# Altium project VXX2.PrjPcb
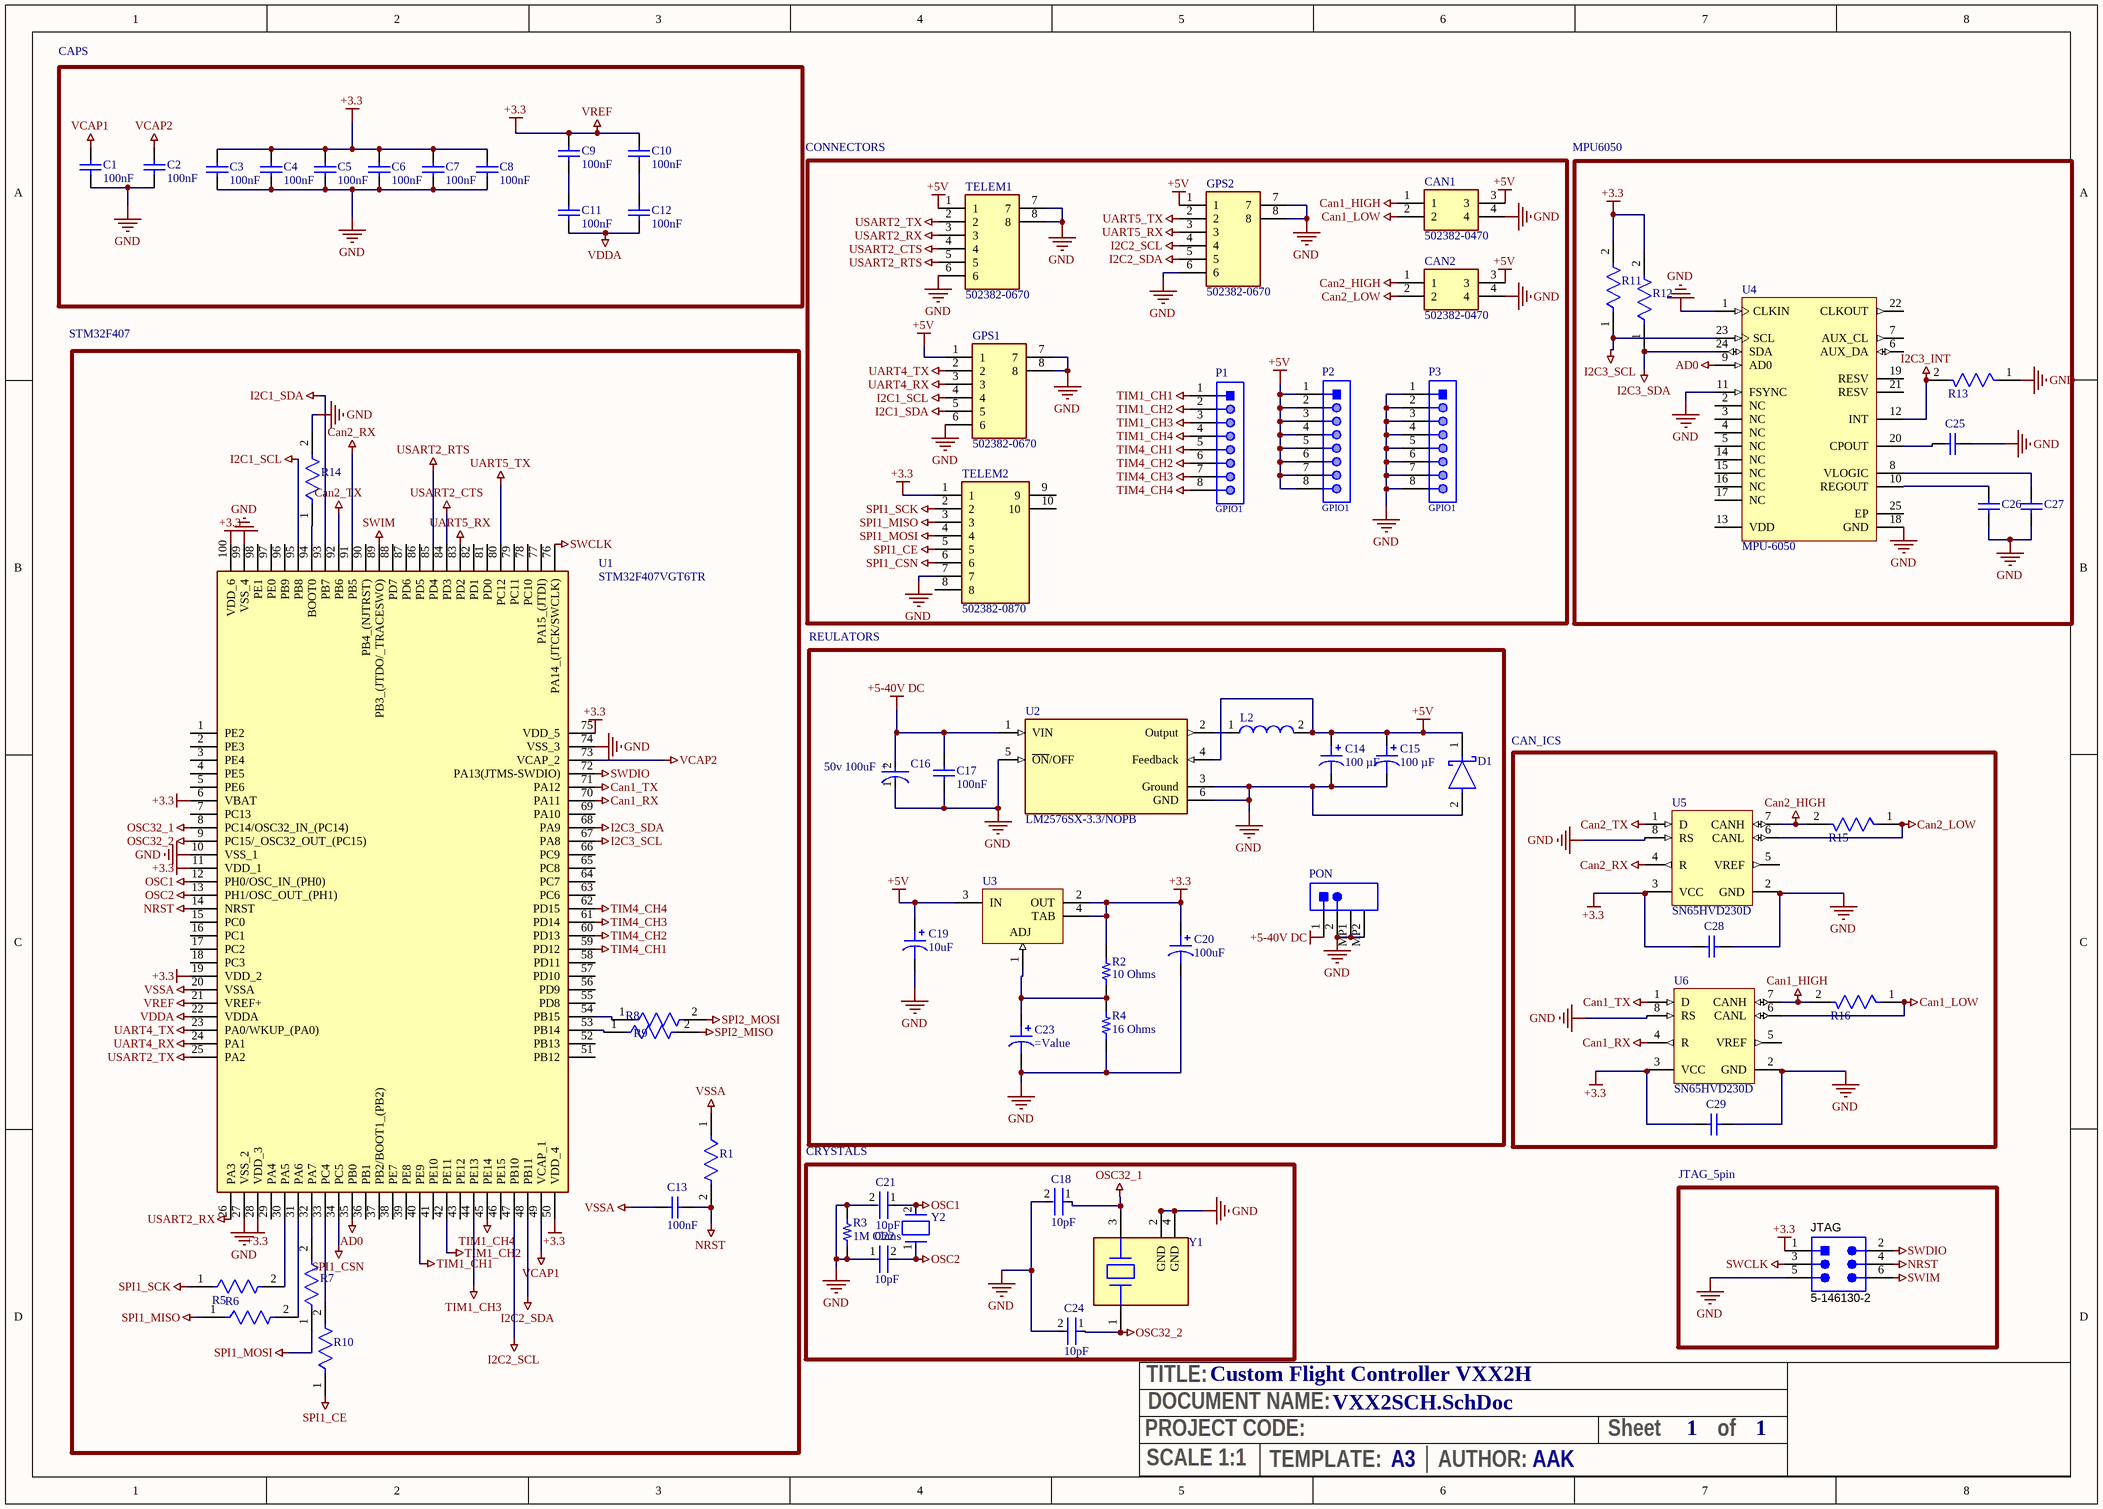
[diagram p0: VXX2SCH.SchDoc]
1 sheet, 66 parts. Net scope: global (net labels, ports and power ports of the same name join across sheets).
Board file: VXX2PCB.PcbDoc

## Sheet VXX2SCH.SchDoc: Custom Flight Controller VXX2H
size A3; Date: 24/06/2022; ApprovedBy: *AAK; CheckedBy: *AAK; Author: AAK; CompanyName: AAK; DrawnBy: *AAK; Engineer: Alper Korkmaz; Organization: *AAK; DocumentNumber: *AAK; Revision: AAK; SheetNumber: 1; SheetTotal: 1; Time: 13.56

### Parts
C1  100nF  [CAPC2013X135X45ML10T25]
C2  100nF  [CAPC2013X135X45ML10T25]
C3  100nF  [CAPC2013X135X45ML10T25]
C4  100nF  [CAPC2013X135X45ML10T25]
C5  100nF  [CAPC2013X135X45ML10T25]
C6  100nF  [CAPC2013X135X45ML10T25]
C7  100nF  [CAPC2013X135X45ML10T25]
C8  100nF  [CAPC2013X135X45ML10T25]
C9  100nF  [CAPC2013X135X45ML10T25]
C10  100nF  [CAPC2013X135X45ML10T25]
C11  100nF  [CAPC2013X135X45ML10T25]
C12  100nF  [CAPC2013X135X45ML10T25]
C13  100nF  [CAPC2013X135X45ML10T25]
C14  100 µF  [CAP ALSMD 6.6MM H8.0MM]
C15  100 µF  [CAP ALSMD 6.6MM H8.0MM]
C16  50v 100uF  [FP-SC-MFG]
C17  100nF  [CAPC2013X135X45ML10T25]
C18  10pF  [FP-C0805C-DN-MFG]
C19  10uF  [CAP ALSMD 4.3MM H5.4MM]
C20  100uF  [CAP ALSMD 4.3MM H5.4MM]
C21  10pF  [FP-C0805C-DN-MFG]
C22  10pF  [FP-C0805C-DN-MFG]
C23  (no value)  [CAP ALSMD 4.3MM H5.4MM]
C24  10pF  [FP-C0805C-DN-MFG]
C25  GRM188R71H222KA01D  [CAPC1608X90X35NL10T15]  (value not drawn)
C26  GRM188R71H222KA01D  [CAPC1608X90X35NL10T15]  (value not drawn)
C27  GRM188R71H222KA01D  [CAPC1608X90X35NL10T15]  (value not drawn)
C28  GRM188R71H222KA01D  [CAPC1608X90X35NL10T15]  (value not drawn)
C29  GRM188R71H222KA01D  [CAPC1608X90X35NL10T15]  (value not drawn)
CAN1  502382-0470  [502382-0470]
CAN2  502382-0470  [502382-0470]
D1  MBR0560-TP  [FP-SOD-123-IPC_C]  (value not drawn)
GPS1  502382-0670  [5023820671]
GPS2  502382-0670  [5023820671]
JTAG  5-146130-2  [TECO-5-146130-2_V]
L2  7447785147  [WE-PD-XS-PB]  (value not drawn)
P1  GPIO1  [61300811121]
P2  GPIO1  [61300811121]
P3  GPIO1  [61300811121]
PON  53398-0271  [MOLX-53398-0271_V]  (value not drawn)
R1  RC0603FR-0710KL  [FP-RC0603-0_55-IPC_C]  (value not drawn)
R2  10 Ohms  [RES 0603_1608]
R3  1M Ohms  [RES 0603_1608]
R4  16 Ohms  [RES 0603_1608]
R5  RC0603FR-07100L  [FP-RC0603-0_55-IPC_C]  (value not drawn)
R6  RC0603FR-07100L  [FP-RC0603-0_55-IPC_C]  (value not drawn)
R7  RC0603FR-07100L  [FP-RC0603-0_55-IPC_C]  (value not drawn)
R8  RC0603FR-07100L  [FP-RC0603-0_55-IPC_C]  (value not drawn)
R9  RC0603FR-07100L  [FP-RC0603-0_55-IPC_C]  (value not drawn)
R10  RC0603FR-07100L  [FP-RC0603-0_55-IPC_C]  (value not drawn)
R11  RC0603FR-07100L  [FP-RC0603-0_55-IPC_C]  (value not drawn)
R12  RC0603FR-07100L  [FP-RC0603-0_55-IPC_C]  (value not drawn)
R13  RC0603FR-07100L  [FP-RC0603-0_55-IPC_C]  (value not drawn)
R14  RC0603FR-0710KL  [FP-RC0603-0_55-IPC_C]  (value not drawn)
R15  RC0603FR-07100L  [FP-RC0603-0_55-IPC_C]  (value not drawn)
R16  RC0603FR-07100L  [FP-RC0603-0_55-IPC_C]  (value not drawn)
TELEM1  502382-0670  [5023820671]
TELEM2  502382-0870  [5023820870]
U1  STM32F407VGT6TR  [QFP50P1600X1600X160-100N]
U2  LM2576SX-3.3/NOPB  [FP-KTT0005B-MFG]
U3  LM1117MPX-ADJ/NOPB  [DCY0004A_N]  (value not drawn)
U4  MPU-6050  [IS-QFN-24_V]
U5  SN65HVD230D  [D0008A_M]
U6  SN65HVD230D  [D0008A_M]
Y1  ABM3B-155-12.800MHZ-T  [FP-ABM3B-MFG]  (value not drawn)
Y2  ABM3-8.000MHZ-D2Y-T  [FP-ABM3-MFG]  (value not drawn)

### Blocks framed on the sheet
CAPS: C1-C12
CONNECTORS: CAN1 CAN2 GPS1 GPS2 P1-P3 TELEM1 TELEM2
MPU6050: C25-C27 R11-R13 U4
STM32F407: C13 R1 R5-R10 R14 U1
REULATORS: C14-C17 C19 C20 C23 D1 L2 PON R2 R4 U2 U3
CAN_ICS: C28 C29 R15 R16 U5 U6
CRYSTALS: C18 C21 C22 C24 R3 Y1 Y2
JTAG_5pin: JTAG

### Nets
+3.3: C3.2 C4.2 C5.2 C6.2 C7.2 C8.2 C9.2 C10.2 C20.1 C28.1 C29.1 JTAG.1 R2.2 R11.2 R12.2 TELEM2.1 U1.6(VBAT) U1.11(VDD_1) U1.19(VDD_2) U1.21(VREF+) U1.28(VDD_3) U1.50(VDD_4) U1.75(VDD_5) U1.100(VDD_6) U3.2(OUT) U3.4(TAB) U5.3(VCC) U6.3(VCC)  [also labelled VREF]
+5-40V DC: C16.2(A) C17.2 PON.1 U2.1(VIN)
+5V: C14.1 C15.1 C19.1 CAN1.3 CAN2.3 D1.1(C) GPS1.1 GPS2.1 L2.2 P2.1 P2.2 P2.3 P2.4 P2.5 P2.6 P2.7 P2.8 TELEM1.1 U2.4(Feedback) U3.3(IN)
AD0: U1.35(PB0) U4.9(AD0)
Can1_HIGH: CAN1.1 R16.2 U6.7(CANH)
Can1_LOW: CAN1.2 R16.1 U6.6(CANL)
Can1_RX: U1.70(PA11) U6.4(R)
Can1_TX: U1.71(PA12) U6.1(D)
Can2_HIGH: CAN2.1 R15.2 U5.7(CANH)
Can2_LOW: CAN2.2 R15.1 U5.6(CANL)
Can2_RX: U1.91(PB5) U5.4(R)
Can2_TX: U1.92(PB6) U5.1(D)
GND: C1.1 C2.1 C3.1 C4.1 C5.1 C6.1 C7.1 C8.1 C14.2 C15.2 C16.1(C) C17.1 C18.2 C19.2 C20.2 C21.2 C22.1 C23.2 C24.2 C25.2 C26.2 C27.2 C28.2 C29.2 CAN1.4 CAN2.4 D1.2(A) GPS1.6 GPS1.7 GPS1.8 GPS2.6 GPS2.7 GPS2.8 JTAG.5 P3.1 P3.2 P3.3 P3.4 P3.5 P3.6 P3.7 P3.8 PON.2 PON.MP1 PON.MP2 R3.1 R3.2 R4.1 R13.1 R14.2 TELEM1.6 TELEM1.7 TELEM1.8 TELEM2.7 U1.10(VSS_1) U1.27(VSS_2) U1.74(VSS_3) U1.99(VSS_4) U2.3(Ground) U2.5(~{ON}/OFF) U2.6(GND) U4.1(CLKIN) U4.11(FSYNC) U4.18(GND) U5.2(GND) U5.8(RS) U6.2(GND) U6.8(RS) Y1.2(GND) Y1.4(GND)
I2C1_SCL: GPS1.4 U1.95(PB8)
I2C1_SDA: GPS1.5 U1.93(PB7)
I2C2_SCL: GPS2.4 U1.47(PB10)
I2C2_SDA: GPS2.5 U1.48(PB11)
I2C3_INT: R13.2 U4.12(INT)
I2C3_SCL: R11.1 U1.67(PA8) U4.23(SCL)
I2C3_SDA: R12.1 U1.68(PA9) U4.24(SDA)
NRST: C13.2 JTAG.4 R1.2 U1.14(NRST)
OSC1: C21.1 U1.12(PH0/OSC_IN_(PH0)) Y2.2
OSC2: C22.2 U1.13(PH1/OSC_OUT_(PH1)) Y2.1
OSC32_1: C18.1 U1.8(PC14/OSC32_IN_(PC14)) Y1.3
OSC32_2: C24.1 U1.9(PC15/_OSC32_OUT_(PC15)) Y1.1
SPI1_CE: R10.1 TELEM2.5
SPI1_CSN: TELEM2.6 U1.34(PC5)
SPI1_MISO: R6.1 TELEM2.3
SPI1_MOSI: R7.1 TELEM2.4
SPI1_SCK: R5.1 TELEM2.2
SPI2_MISO: R8.2
SPI2_MOSI: R9.2
SWCLK: JTAG.3 U1.76(PA14_(JTCK/SWCLK))
SWDIO: JTAG.2 U1.72(PA13(JTMS-SWDIO))
SWIM: JTAG.6 U1.89(PB3_(JTDO/_TRACESWO))
TIM1_CH1: P1.1 U1.40(PE9)
TIM1_CH2: P1.2 U1.42(PE11)
TIM1_CH3: P1.3 U1.44(PE13)
TIM1_CH4: P1.4 U1.45(PE14)
TIM4_CH1: P1.5 U1.59(PD12)
TIM4_CH2: P1.6 U1.60(PD13)
TIM4_CH3: P1.7 U1.61(PD14)
TIM4_CH4: P1.8 U1.62(PD15)
UART4_RX: GPS1.3 U1.24(PA1)
UART4_TX: GPS1.2 U1.23(PA0/WKUP_(PA0))
UART5_RX: GPS2.3 U1.83(PD2)
UART5_TX: GPS2.2 U1.80(PC12)
USART2_CTS: TELEM1.4 U1.84(PD3)
USART2_RTS: TELEM1.5 U1.85(PD4)
USART2_RX: TELEM1.3 U1.26(PA3)
USART2_TX: TELEM1.2 U1.25(PA2)
VCAP1: C1.2 U1.49(VCAP_1)
VCAP2: C2.2 U1.73(VCAP_2)
VDDA: C11.1 C12.1 U1.22(VDDA)
VSSA: C13.1 R1.1 U1.20(VSSA)
NetC9_1: C9.1 C11.2
NetC10_1: C10.1 C12.2
NetC23_1: C23.1 R2.1 R4.2 U3.1(ADJ)
NetC25_1: C25.1 U4.20(CPOUT)
NetC26_1: C26.1 U4.10(REGOUT)
NetC27_1: C27.1 U4.8(VLOGIC)
NetL2_1: L2.1 U2.2(Output)
NetR5_2: R5.2 U1.30(PA5)
NetR6_2: R6.2 U1.31(PA6)
NetR7_2: R7.2 U1.32(PA7)
NetR8_1: R8.1 U1.53(PB14)
NetR9_1: R9.1 U1.54(PB15)
NetR10_2: R10.2 U1.33(PC4)
NetR14_1: R14.1 U1.94(BOOT0)

Not connected (* = marked no-connect by the designer): TELEM2 8 9 10; U1 1(PE2) 2(PE3) 3(PE4) 4(PE5) 5(PE6) 7(PC13) 15(PC0) 16(PC1) 17(PC2) 18(PC3) 29(PA4) 36(PB1) 37(PB2/BOOT1_(PB2)) 38(PE7) 39(PE8) 41(PE10) 43(PE12) 46(PE15) 51(PB12) 52(PB13) 55(PD8) 56(PD9) 57(PD10) 58(PD11) 63(PC6) 64(PC7) 65(PC8) 66(PC9) 69(PA10) 77(PA15_(JTDI)) 78(PC10) 79(PC11) 81(PD0) 82(PD1) 86(PD5) 87(PD6) 88(PD7) 90(PB4_(NJTRST)) 96(PB9) 97(PE0) 98(PE1); U4 2(NC) 3(NC) 4(NC) 5(NC) 6(AUX_DA) 7(AUX_CL) 13(VDD) 14(NC) 15(NC) 16(NC) 17(NC) 19(RESV) 21(RESV) 22(CLKOUT) 25(EP); U5 5(VREF); U6 5(VREF)

### Notes on the sheet
- TITLE:
- PROJECT CODE:
- DOCUMENT NAME:
- Sheet
- of
- SCALE 1:1
- TEMPLATE:
- A3
- AUTHOR:
- (in symbol CMP-05427-000087-1) +

### Library data of the parts
C1-C13 C17 = CMP-2100-03644-1: Chip Capacitor, 0.1 uF, +/- 10%, 50 V, -55 to 125 degC, 0805 (2012 Metric), RoHS, Tape and Reel; Manufacturer: Murata; Voltage: 50V; Insulation Resistance: 10GR; Dielectric Material: Ceramic; Dielectric: X7R; Package Description: 2-Pin Surface Mount Device, Body 2 x 1.25 mm; Manufacturer URL: http://www.murata.com/; Case Code (Imperial): 0805; Capacitance: 100nF; Datasheet URL: http://psearch.en.murata.com/capacitor/product/GRM21BR71H104KA01%23.pdf; Termination: SMD/SMT; Lead Free: LeadFree; Package Quantity: 1; Mount: SurfaceMount; REACH SVHC: Unknown; Thickness: 0.053inch; Height: 1.25mm; Case/Package: 0805; Voltage Rating: 50V; Width: 0.049inch; Case Code (Metric): 2012; Material: Ceramic; Min Operating Temperature: -55degC; RoHSCompliant: true; Datasheet Version: 42675.0; Voltage Rating (DC): 50V; Tolerance: 10%; Package Reference: 0805; Depth: 1.25mm; Length: 2mm; Max Operating Temperature: 125degC; Packaging: TapeandReel; Number of Pins: 2; Radiation Hardening: No
C14 C15 = UCD1E101MCL1GS: CAP ALUM 100UF 20% 25V SMD; manufacturer: Nichicon; Impedance: 320 mOhms; Lifetime @ Temp.: 2000 Hrs @ 105°C; Polarization: Polar; Ripple Current @ High Frequency: 290 mA @ 100 kHz; Ripple Current @ Low Frequency: 145 mA @ 120 Hz; Surface Mount Land Size: 0.260" L x 0.260" W (6.60mm x 6.60mm); Part Number: UCD1E101MCL1GS; Applications: Automotive; Capacitance: 100 µF; componentlink1description: Datasheet; componentlink1url: http://nichicon-us.com/english/products/pdfs/e-ucd.pdf; componentlink2description: DigiKey Link; componentlink2url: https://www.digikey.com/en/products/detail/nichicon/UCD1E101MCL1GS/2549660; Device Package: Radial, Can - SMD; Height - Seated (Max): 0.315" (8.00mm); lastupdated: 16.05.2022 12:14:18; Lifecycle Status: Active; Minimum Order: 1; Mounting Type: Surface Mount; Operating Temperature: -55°C ~ 105°C; Package / Case: Radial, Can - SMD; packaging: TapeAndReel; partid: 27421; Part Status: Active; price: 0.15; Ratings: AEC-Q200; series: UCD; Size / Dimension: 0.248" Dia (6.30mm); Supplier 1: DigiKey; Supplier Part Number 1: 493-6376-1-ND; Tolerance: ±20%; value: 100 µF; Voltage - Rated: 25 V
C16 = CMP-05427-000087-1: CAP ALUM 10UF 20% 35V SMD; Life (Hours): 2000Hour; Lead Length: 2.2mm; Ripple Current (AC): 30mA; Leakage Current: 3uA; Length: 5.5mm; Construction: Cylindrical; Diameter: 5mm; RoHS Compliant: Yes; REACH SVHC: No SVHC; Capacitance: 10uF; Max Operating Temperature: 85°C; Series: S; Case/Package: Radial; Contact Plating: Tin; Packaging: Tape and Reel; Voltage Rating: 35V; Number of Pins: 2; Height: 5.4mm; Width: 5.3mm; Voltage Rating (DC): 35V; Mount: Surface Mount; Tolerance: 20%; Lead Pitch: 1.5mm; Radiation Hardening: No; Height - Seated (Max): 0.213inch; Ripple Current: 30mA; Voltage: 35V; Package Quantity: 1; Termination: SMD/SMT; Min Operating Temperature: -40°C
C18 C21 C22 C24 = CMP-2007-00219-2: Capacitor; Ceramic; Cap 10 pF; Tol 5%; Vol-Rtg 50 VDC; SMT; 0805; COG (NPO); Tape&Reel; Manufacturer Part Number: C0805C100J5GACTU; Manufacturer: KEMET; Temperature Coefficient: 30ppm/°C; Voltage Rating: 50 V; Tolerance: 0.05; Temperature Characteristic: C0G; RoHS: TRUE; Mouser Description: KEMET - C0805C100J5GACTU - CAP, MLCC, C0G/NP0, 10PF, 50V, 0805; Temperature Range High: +125°C; Octopart: https://octopart.com/c0805c100j5gactu-kemet-104357; Automotive: No; Device Class L1: Passive Components; Temperature Range Low: -55°C; Value: 10 pF; Device Class L3: Ceramic Capacitors; Material: Ceramic; Device Class L2: Capacitors; Lead Free: Yes; Category: Cap; Ipc Land Pattern Name: CAPC200125X78; ComponentLink2Description: Datasheet; ComponentLink2URL: https://content.kemet.com/datasheets/KEM_C1003_C0G_SMD.pdf; Digikey Description: Capacitor; Ceramic; Cap 10 pF; Tol 5%; Vol-Rtg 50 VDC; SMT; 0805; COG (NPO); Tape&Reel; Temperature: -55°C to +125°C; Height: 0.88mm; Capacitance: 10 pF; Package: C0805C-DN
C19 C20 C23 = UWX1C100MCL1GB: CAP ALUM 10UF 20% 16V SMD; Part Number: UWX1C100MCL1GB
C25-C29 = CMP-2006-02908-5: Chip Capacitor, 2.2 nF, +/- 10%, 50 V, -55 to 125 degC, 0603 (1608 Metric), RoHS, Tape and Reel; Manufacturer: Murata; Voltage Rating: 50 V; Pins: 2; Mount: Surface Mount; Max Operating Temperature: 125 degC; ComponentLink1Description: Manufacturer URL; RoHSCompliant: true; PackageDescription: 2-Pin Surface Mount Device, Body 1.6 x 0.8 mm; ComponentLink2URL: http://search.murata.co.jp/Ceramy/image/img/A01X/G101/ENG/GRM188R71H222KA01-01.pdf; PackageReference: 0603; Height: 0.8 mm; Lead Pitch: 4 mm; Packaging: Tape and Reel; DatasheetVersion: 02/2016; Mounting Technology: Surface Mount; ComponentLink2Description: Datasheet; Min Operating Temperature: -55 degC; Length: 1.6 mm; REACH SVHC: No SVHC; Package Quantity: 4000; ComponentLink1URL: http://www.murata.com/
CAN1 CAN2 = 502382-0470: Connector; Manufacturer_Name: Molex; Datasheet Link: http://www.molex.com/webdocs/datasheets/pdf/en-us//5023820470_PCB_RECEPTACLES.pdf; Manufacturer_Part_Number: 502382-0470; Mouser Part Number: 538-502382-0470; Mouser Price/Stock: https://www.mouser.co.uk/ProductDetail/Molex/502382-0470?qs=Fn3VdHBzkcl78T2%252BGlINlA%3D%3D; Arrow Part Number: 502382-0470; Arrow Price/Stock: https://www.arrow.com/en/products/5023820470/molex
D1 = CMP-56206-000010-1: DIODE SCHOTTKY 60V 500MA SOD123; Max Reverse Current: 200uA; Element Configuration: Single; Polarity: Standard; Capacitance: 30pF; Forward Voltage: 700mV; Peak Non-Repetitive Surge Current: 5.5A; Average Rectified Current: 500mA; Current Rating: 500mA; Max Reverse Voltage (DC): 60V; Max Operating Temperature: 150°C; Min Operating Temperature: -55°C; RoHS Compliant: Yes; Max Repetitive Reverse Voltage (Vrrm): 60V; Packaging: Tape and Reel; Voltage Rating (DC): 60V; Output Current: 500mA; Lead Free: Lead Free; Max Reverse Leakage Current: 200uA; Package Quantity: 1; Mount: Surface Mount; Max Surge Current: 5.5A; Radiation Hardening: No; Number of Pins: 2
GPS1 GPS2 TELEM1 = 502382-0670: Connector; Manufacturer_Name: Molex; Datasheet Link: https://www.molex.com/pdm_docs/sd/5023820670_sd.pdf; Height: 5mm; Manufacturer_Part_Number: 502382-0670; Mouser Part Number: 538-502382-0670; Mouser Price/Stock: https://www.mouser.co.uk/ProductDetail/Molex/502382-0670?qs=Fn3VdHBzkck%252BbtaOMPy4zQ%3D%3D; Arrow Part Number: 502382-0670; Arrow Price/Stock: https://www.arrow.com/en/products/502382-0670/molex
JTAG = CMP-1684-00011-1: Male Header, Pitch 2.54 mm, 2 x 3 Position, Height 8.13 mm, -65 to 125 degC, RoHS, Tube; Max Supply Voltage: 5.5 V; Min Supply Voltage: 4.5 V; Nominal Supply Voltage: 5 V; Min Operating Temperature: -40 degC; ComponentLink1URL: http://www.te.com/; ComponentLink2Description: Datasheet; Pins: 3; Max Operating Temperature: 150 degC; PackageDescription: Male Header, Pitch 2.54 mm, 2 x 3 Position, Height 8.13 mm; Package Quantity: 3000; PackageReference: 5-146130-2; DatasheetVersion: Oct-15; ComponentLink1Description: Manufacturer URL; Radiation Hardening: No; Mount: Surface Mount; RoHSCompliant: true; Packaging: Tape and Reel; ComponentLink2URL: http://www.te.com/commerce/DocumentDelivery/DDEController?Action=showdoc&DocId=Customer+Drawing%7F146130%7FM%7Fpdf%7FEnglish%7FENG_CD_146130_M.pdf%7F5-146130-2
L2 = CMP-0227-00289-1: SMD-Shielded Power Inductor WE-PD, L = 47.0 µH; Inductance: 47.0 ÂµH; ComponentLink1URL: http://www.we-online.com; ComponentLink2Description: Datasheet; PackageReference: WE-PD-XS-PB; DatasheetVersion: ver 2, Oct-2004; PackageDescription: SMD Inductor, 2-Leads, Body 5.9 x 6.2 mm; ComponentLink2URL: http://www.we-online.de/katalog/media/pdf/7447785147.pdf; ComponentLink1Description: Manufacturer Link; PackageVersion: 2004
P1-P3 = CMP-1502-01076-1: THT Vertical Pin Header WR-PHD, Pitch 2.54 mm, Single Row, 8 pins; Manufacturer: Wurth Elektronik; Rated Current: 3A; Pin Number: 8; Working Voltage: 250VAC; Gender: Male; Contact Resistance: 20mOhm; Pitch: 2.54mm; Withstanding Voltage: 500VAC; Publisher: WurthElektronik; Operating Temperature: -40to105degC; Orientation: Vertical; Row Number: Single; Part Number: 61300811121; Package Reference: 61300811121; Mounting Technology: THT; Packaging: Bag; Manufacturer URL: http://www.we-online.de; Datasheet URL: https://katalog.we-online.de/em/datasheet/6130xx11121.pdf
PON = CMP-2000-07600-1: Male Header, Pitch 1.25 mm, 1 x 2 Position, Height 4.7 mm, -40 to 85 degC, RoHS, Tape and Reel; Manufacturer: Molex; Voltage Rating: 125V; Glow Wire Compliant: Non-compliant; Pitch: 1.25mm; Number of Positions: 2; Contact Resistance: 20mOhm; Insulation Resistance: 100MOhm; Current Rating: 1A; Mounting Technology: SurfaceMount; Colour: Natural; Mount: SurfaceMount; Termination: Solder; Packaging: TapeandReel; REACH SVHC: Unknown; Voltage Rating (AC): 125V; Housing Colour: Natural; Manufacturer URL: http://www.molex.com/; Max Operating Temperature: 85degC; Gender: Male; Lead Free: LeadFree; RoHSCompliant: True; Contact Plating: Tin; Package Reference: 53398-0271; Contact Material: Tin; Orientation: Vertical; Datasheet URL: http://www.molex.com/pdm_docs/sd/533980271_sd.pdf; Working Voltage: 125V; Flammability Rating: UL94V-0; Number of Contacts: 2; Package Description: Male Header, Pitch 1.25 mm, 1 x 2 Position, Height 4.7 mm; Datasheet Version: Rev. J, 09/2015; Number of Circuits: 2; Number of Rows: 1; Radiation Hardening: No; Voltage Rating (DC): 125V; Min Operating Temperature: -40degC; Housing Material: Nylon; Package Quantity: 1000
R1 R14 = CMP-2100-03664-2: RES 10K OHM 1% 1/10W 0603; Voltage Rating: 75V; Voltage Rating (DC): 50V; Resistance: 10kR; Power Rating: 100mW; Temperature Coefficient: 100ppm/°C; Depth: 0.8mm; Termination: SMD/SMT; Resistor Type: Thick Film; Series: RC; Construction: Rectangular; Features: Moisture Resistant; Packaging: Tape and Reel; Min Operating Temperature: -55°C; Number of Terminations: 2; Lead Pitch: 0.3mm; RoHS Compliant: Yes; Case/Package: 0603; Resistance Tolerance: 1%; Military Standard: Not; Weight: 7.1E-05oz; Number of Pins: 2; Tolerance: 1%; Length: 1.6mm; Case Code (Imperial): 0603; Lead Free: Lead Free; Width: 0.8mm; Max Power Dissipation: 100mW; Height: 0.45mm; Max Operating Temperature: 155°C; Case Code (Metric): 1608; Size Code: 0603
R2-R4 = RNCS0603BKE10K0: RES 10K OHM 0.1% 1/16W 0603; Manufacturer: Stackpole Electronics Inc; Power (Watts): 0.063W, 1/16W; Resistance: 10 kOhms; Temperature Coefficient: ±25ppm/°C; Part Number: RNCS0603BKE10K0; ComponentLink1Description: Datasheet; ComponentLink1URL: https://www.seielect.com/catalog/sei-rncs_rnch.pdf; ComponentLink2Description: DigiKey Link; ComponentLink2URL: https://www.digikey.com/en/products/detail/stackpole-electronics-inc/RNCS0603BKE10K0/1708836; Composition: Thin Film; Device Package: 0603 (1608 Metric); Features: Anti-Corrosive, Automotive AEC-Q200, Moisture Resistant; Height - Seated (Max): 0.022" (0.55mm); LastUpdated: 23.05.2022 13:14:49; Lifecycle Status: Active; Minimum Order: 1; Number of Terminations: 2; Operating Temperature: -55°C ~ 155°C; Package / Case: 0603 (1608 Metric); Packaging: TapeAndReel; PartId: 4838; Part Status: Active; Price: 0.08; Ratings: AEC-Q200; Series: RNCS; Size / Dimension: 0.061" L x 0.031" W (1.55mm x 0.80mm); Supplier 1: DigiKey; Supplier Part Number 1: RNCS0603BKE10K0CT-ND; Supplier Device Package: 0603; Tolerance: ±0.1%
  R2: Value: 10 Ohms
  R3: Value: 1M Ohms
  R4: Value: 16 Ohms
R5-R13 = CMP-2100-03664-2: RES 100 OHM 1% 1/10W 0603; Voltage Rating: 75V; Voltage Rating (DC): 50V; Resistance: 10kR; Power Rating: 100mW; Temperature Coefficient: 100ppm/°C; Depth: 0.8mm; Termination: SMD/SMT; Resistor Type: Thick Film; Series: RC; Construction: Rectangular; Features: Moisture Resistant; Packaging: Tape and Reel; Min Operating Temperature: -55°C; Number of Terminations: 2; Lead Pitch: 0.3mm; RoHS Compliant: Yes; Case/Package: 0603; Resistance Tolerance: 1%; Military Standard: Not; Weight: 7.1E-05oz; Number of Pins: 2; Tolerance: 1%; Length: 1.6mm; Case Code (Imperial): 0603; Lead Free: Lead Free; Width: 0.8mm; Max Power Dissipation: 100mW; Height: 0.45mm; Max Operating Temperature: 155°C; Case Code (Metric): 1608; Size Code: 0603
R15 R16 = CMP-2100-03664-2: RES 120 OHM 1% 1/10W 0603; Voltage Rating: 75V; Voltage Rating (DC): 50V; Resistance: 10kR; Power Rating: 100mW; Temperature Coefficient: 100ppm/°C; Depth: 0.8mm; Termination: SMD/SMT; Resistor Type: Thick Film; Series: RC; Construction: Rectangular; Features: Moisture Resistant; Packaging: Tape and Reel; Min Operating Temperature: -55°C; Number of Terminations: 2; Lead Pitch: 0.3mm; RoHS Compliant: Yes; Case/Package: 0603; Resistance Tolerance: 1%; Military Standard: Not; Weight: 7.1E-05oz; Number of Pins: 2; Tolerance: 1%; Length: 1.6mm; Case Code (Imperial): 0603; Lead Free: Lead Free; Width: 0.8mm; Max Power Dissipation: 100mW; Height: 0.45mm; Max Operating Temperature: 155°C; Case Code (Metric): 1608; Size Code: 0603
TELEM2 = 502382-0870: Connector; Manufacturer_Name: Molex; Datasheet Link: https://www.molex.com/webdocs/datasheets/pdf/en-us/5023820870_PCB_RECEPTACLES.pdf; Height: 4mm; Manufacturer_Part_Number: 502382-0870; Mouser Part Number: 538-502382-0870; Mouser Price/Stock: https://www.mouser.co.uk/ProductDetail/Molex/502382-0870?qs=Fn3VdHBzkckjet%2FivyKiZw%3D%3D; Arrow Part Number: 502382-0870; Arrow Price/Stock: https://www.arrow.com/en/products/502382-0870/molex
U1 = STM32F407VGT6TR: Integrated Circuit; Manufacturer_Name: STMicroelectronics; Datasheet Link: https://www.st.com/resource/en/datasheet/stm32f407vg.pdf; Height: 1.6mm; Manufacturer_Part_Number: STM32F407VGT6TR; Mouser Part Number: 511-STM32F407VGT6TR; Mouser Price/Stock: https://www.mouser.co.uk/ProductDetail/STMicroelectronics/STM32F407VGT6TR?qs=gNDSiZmRJS%2Fm459dFMQZBA%3D%3D; Arrow Part Number: STM32F407VGT6TR; Arrow Price/Stock: https://www.arrow.com/en/products/stm32f407vgt6tr/stmicroelectronics?region=nac
U2 = CMP-0069-00122-4: IC REG BUCK 5V 3A TO263-5; Efficiency: 77%; Min Input Voltage: 4V; Quiescent Current: 5mA; Synchronous Rectifier: No; Operating Supply Voltage: 40V; Number of Outputs: 1; Switching Frequency: 52kHz; Output Type: Fixed; Max Operating Temperature: 125°C; Radiation Hardening: No; REACH SVHC: No SVHC; Package Quantity: 500; Max Output Current: 3A; Case/Package: TO-263-6; Lead Free: Contains Lead; Contact Plating: Tin; Series: SIMPLE SWITCHER®; Nominal Output Voltage: 5V; Packaging: Tape and Reel; Number of Pins: 5; Max Input Voltage: 40V; Output Voltage: 5V; Min Operating Temperature: -40°C; Output Current: 3A; Mount: Surface Mount
U3 = CMP-0062-01644-4: 800mA Low-Dropout Linear Regulator, 4-pin SOT-223, Pb-Free; Manufacturer: Texas Instruments; CompType: LDO IC; PowerWise: N; PackageTopMarking: XYTT*N03A; High-Reliability: Y; PackageDescription: Molded SOT-223, 6.50 x 3.56 x 1.6mm Body, 4 Lead, 2.3mm Pitch; RoHS: Y; ComponentLink1URL: http://www.ti.com/general/docs/lit/getliterature.tsp?genericPartNumber=LM1117-N&fileType=pdf; Code_JEDEC: TO-261-AA; ComponentLink1Description: Datasheet URL; PartNumber: LM1117MPX-ADJ/NOPB; PackageReference: DCY0004A; Code_IPC: SOT223-4; PinCount: 4
U4 = CMP-1753-00002-2: 3-Axis Gyroscope, Accelerometer and a Digital Motion Processor(TM) (DMP), 2.375 to 3.46 V, -40 to 85 degC, 24-Pin QFN, RoHS, Tape and Reel; Manufacturer: InvenSense; Featured Product: MPU-60506-Axis,IntegratedI²CSolution; Other Names: 1428-1007-2 / MPU6050; Sensor Type: MotionTracking; Online Catalog: MPU-6000™Series; Unit PriceUSD: Digital; Datasheet Version: Rev. 3.3, 05/2012; Category: Sensors,Transducers; Datasheet URL: http://datasheet.octopart.com/MPU-6050-InvenSense-datasheet-14421344.pdf; Family: Multifunction; Standard Package: 5,000; Manufacturer URL: http://www.invensense.com/; Output Type: Digital; Dynamic Catalog: MPU-6000™Series
U5 U6 = CMP-0315-00046-3: CAN Bus Transceiver, 3.3 V, -40 to 85 degC, 8-Pin SOIC (D), Green (RoHS & no Sb/Br), Tube; Supply Voltage Min: 3 V; Supply Voltage Max: 3.6 V; PartNumber: SN65HVD230D; ComponentLink2URL: http://www.ti.com/general/docs/lit/getliterature.tsp?genericGeneric Part Number=SN65HVD230&fileType=pdf; DatasheetVersion: SLOS346N; Generic Part Number: SN65HVD230; Packing: Tube; Temperature Min: -40 degC; Temperature Max: 85 degC; ComponentLink1Description: Manufacturer URL; Mounting Technology: Surface Mount; RoHS: TRUE; ComponentLink1URL: http://www.ti.com/; ComponentLink2Description: Datasheet; PackageDescription: 8-Pin Plastic Small Outline, Body 4.9 x 3.9 mm, Pitch 1.27 mm
Y1 = CMP-27762-002684-1: Crystal 12.8MHz ±10ppm 15pF SMD-4 5mm x 3.2mm; ESR (Equivalent Series Resistance): 70R; Tolerance: 50ppm; Frequency Stability: 20ppm; Height: 0.043inch; Series: ABM3B; Resistor Type: Ceramic; Frequency: 12.8MHz; Mount: Surface Mount; Package Quantity: 1000; Packaging: Tape and Reel; Termination: SMD/SMT; Lead Free: Lead Free; Case/Package: SMD/SMT; Load Capacitance: 15pF; Frequency Tolerance: 10ppm; REACH SVHC: No SVHC; Min Operating Temperature: -40°C; Max Operating Temperature: 85°C; Width: 0.126inch; Length: 0.197inch; RoHS Compliant: Yes
Y2 = CMP-2000-05033-2: Crystal 8MHz ±20ppm 18pF SMD-2 5mm x 3.2mm; Series Resistance: 500R; Frequency Stability: 30ppm; ESR (Equivalent Series Resistance): 140R; Load Capacitance: 18pF; Height: 0.051inch; Tolerance: 20ppm; Depth: 3.2mm; Max Operating Temperature: 85°C; Frequency: 8MHz; Termination: SMD/SMT; Lead Free: Lead Free; Number of Pins: 2; Width: 3.2mm; RoHS Compliant: Yes; Resistor Type: Ceramic; Length: 5mm; Mount: Surface Mount; Case/Package: CSMD; Package Quantity: 1000; Radiation Hardening: No; Min Operating Temperature: -40°C; Packaging: Tape and Reel; Frequency Tolerance: 20ppm